# EAGLE schematic esp-wroom-02-wifi (EAGLE 7.3.0)
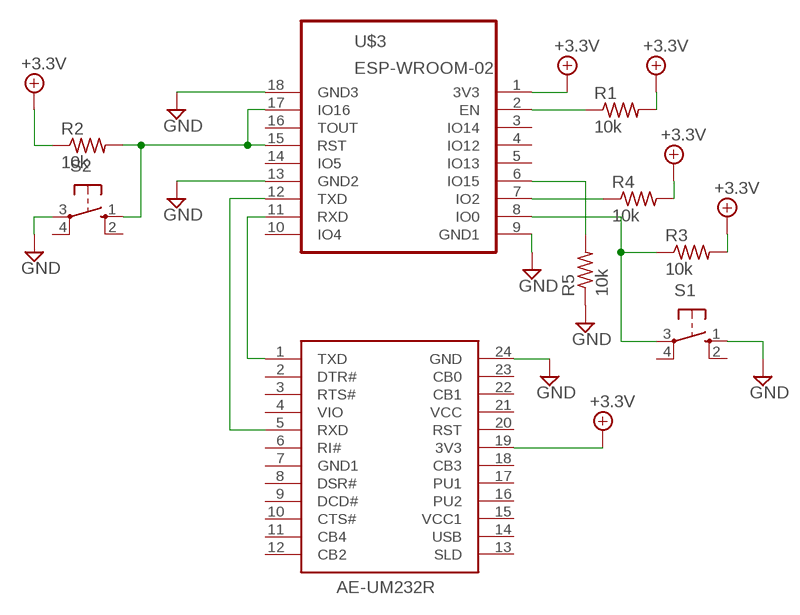
[diagram p0: schematic, sheet 1]

## Parts
R1  10k  R-US_0204/7  [0204/7]
R2  10k  R-US_0204/7  [0204/7]
R3  10k  R-US_0204/7  [0204/7]
R4  10k  R-US_0204/7  [0204/7]
R5  10k  R-US_0204/7  [0204/7]
S1  10-XX  [B3F-10XX]
S2  10-XX  [B3F-10XX]
U$1  AE-UM232R  [AE-UM232R]
U$3  ESP-WROOM-02  [ESP-WROOM-02]

## Nets
+4.1V: R1.2 R2.1 R3.2 R4.2 U$1.19(3V3) U$3.1(3V3) ; supply symbol labelled +3.3V
GND: R5.1 S1.1(S) S2.3(P) U$3.9(GND1) U$3.13(GND2) U$3.18(GND3)
N$1: U$1.24(GND) ; supply symbol labelled GND
N$2: U$1.1(TXD) U$3.11(RXD)
N$3: U$1.5(RXD) U$3.12(TXD)
N$4: R1.1 U$3.2(EN)
N$5: R2.2 S2.1(S) U$3.15(RST) U$3.17(IO16)
N$6: R4.1 U$3.7(IO2)
N$7: R3.1 S1.3(P) U$3.8(IO0)
N$8: R5.2 U$3.6(IO15)
Unconnected: S1.2(S1) S1.4(P1) S2.2(S1) S2.4(P1) U$1.2(DTR#) U$1.3(RTS#) U$1.4(VIO) U$1.6(RI#) U$1.8(DSR#) U$1.9(DCD#) U$1.10(CTS#) U$1.11(CB4) U$1.12(CB2) U$1.13(SLD) U$1.14(USB) U$1.16(PU2) U$1.17(PU1) U$1.18(CB3) U$1.20(RST) U$1.22(CB1) U$1.23(CB0) U$3.3(IO14) U$3.4(IO12) U$3.5(IO13) U$3.10(IO4) U$3.14(IO5) U$3.16(TOUT)

## Power pins joined to a net without a drawn wire
GND1: U$1.7(GND1)
VCC: U$1.21(VCC)
VCC1: U$1.15(VCC1)

## Library data of the parts
R1-R5 = resistor:R-US_: RESISTOR, American symbol
S1 S2 = switch-omron:10-XX: OMRON SWITCH; MPN: B3F-1000; OC_FARNELL: 176432; OC_NEWARK: 36M3542
U$1 = AE-UM232R:AE-UM232R: FT232RL USB-Serial Converter - AE-UM232R
U$3 = esp-wroom-02:ESP-WROOM-02: WiFi module - ESP-WROOM-02